# Altium schematic sheet Sheet4.SchDoc (part 1 of 3)
size E; SheetNumber: 1; SheetTotal: 1
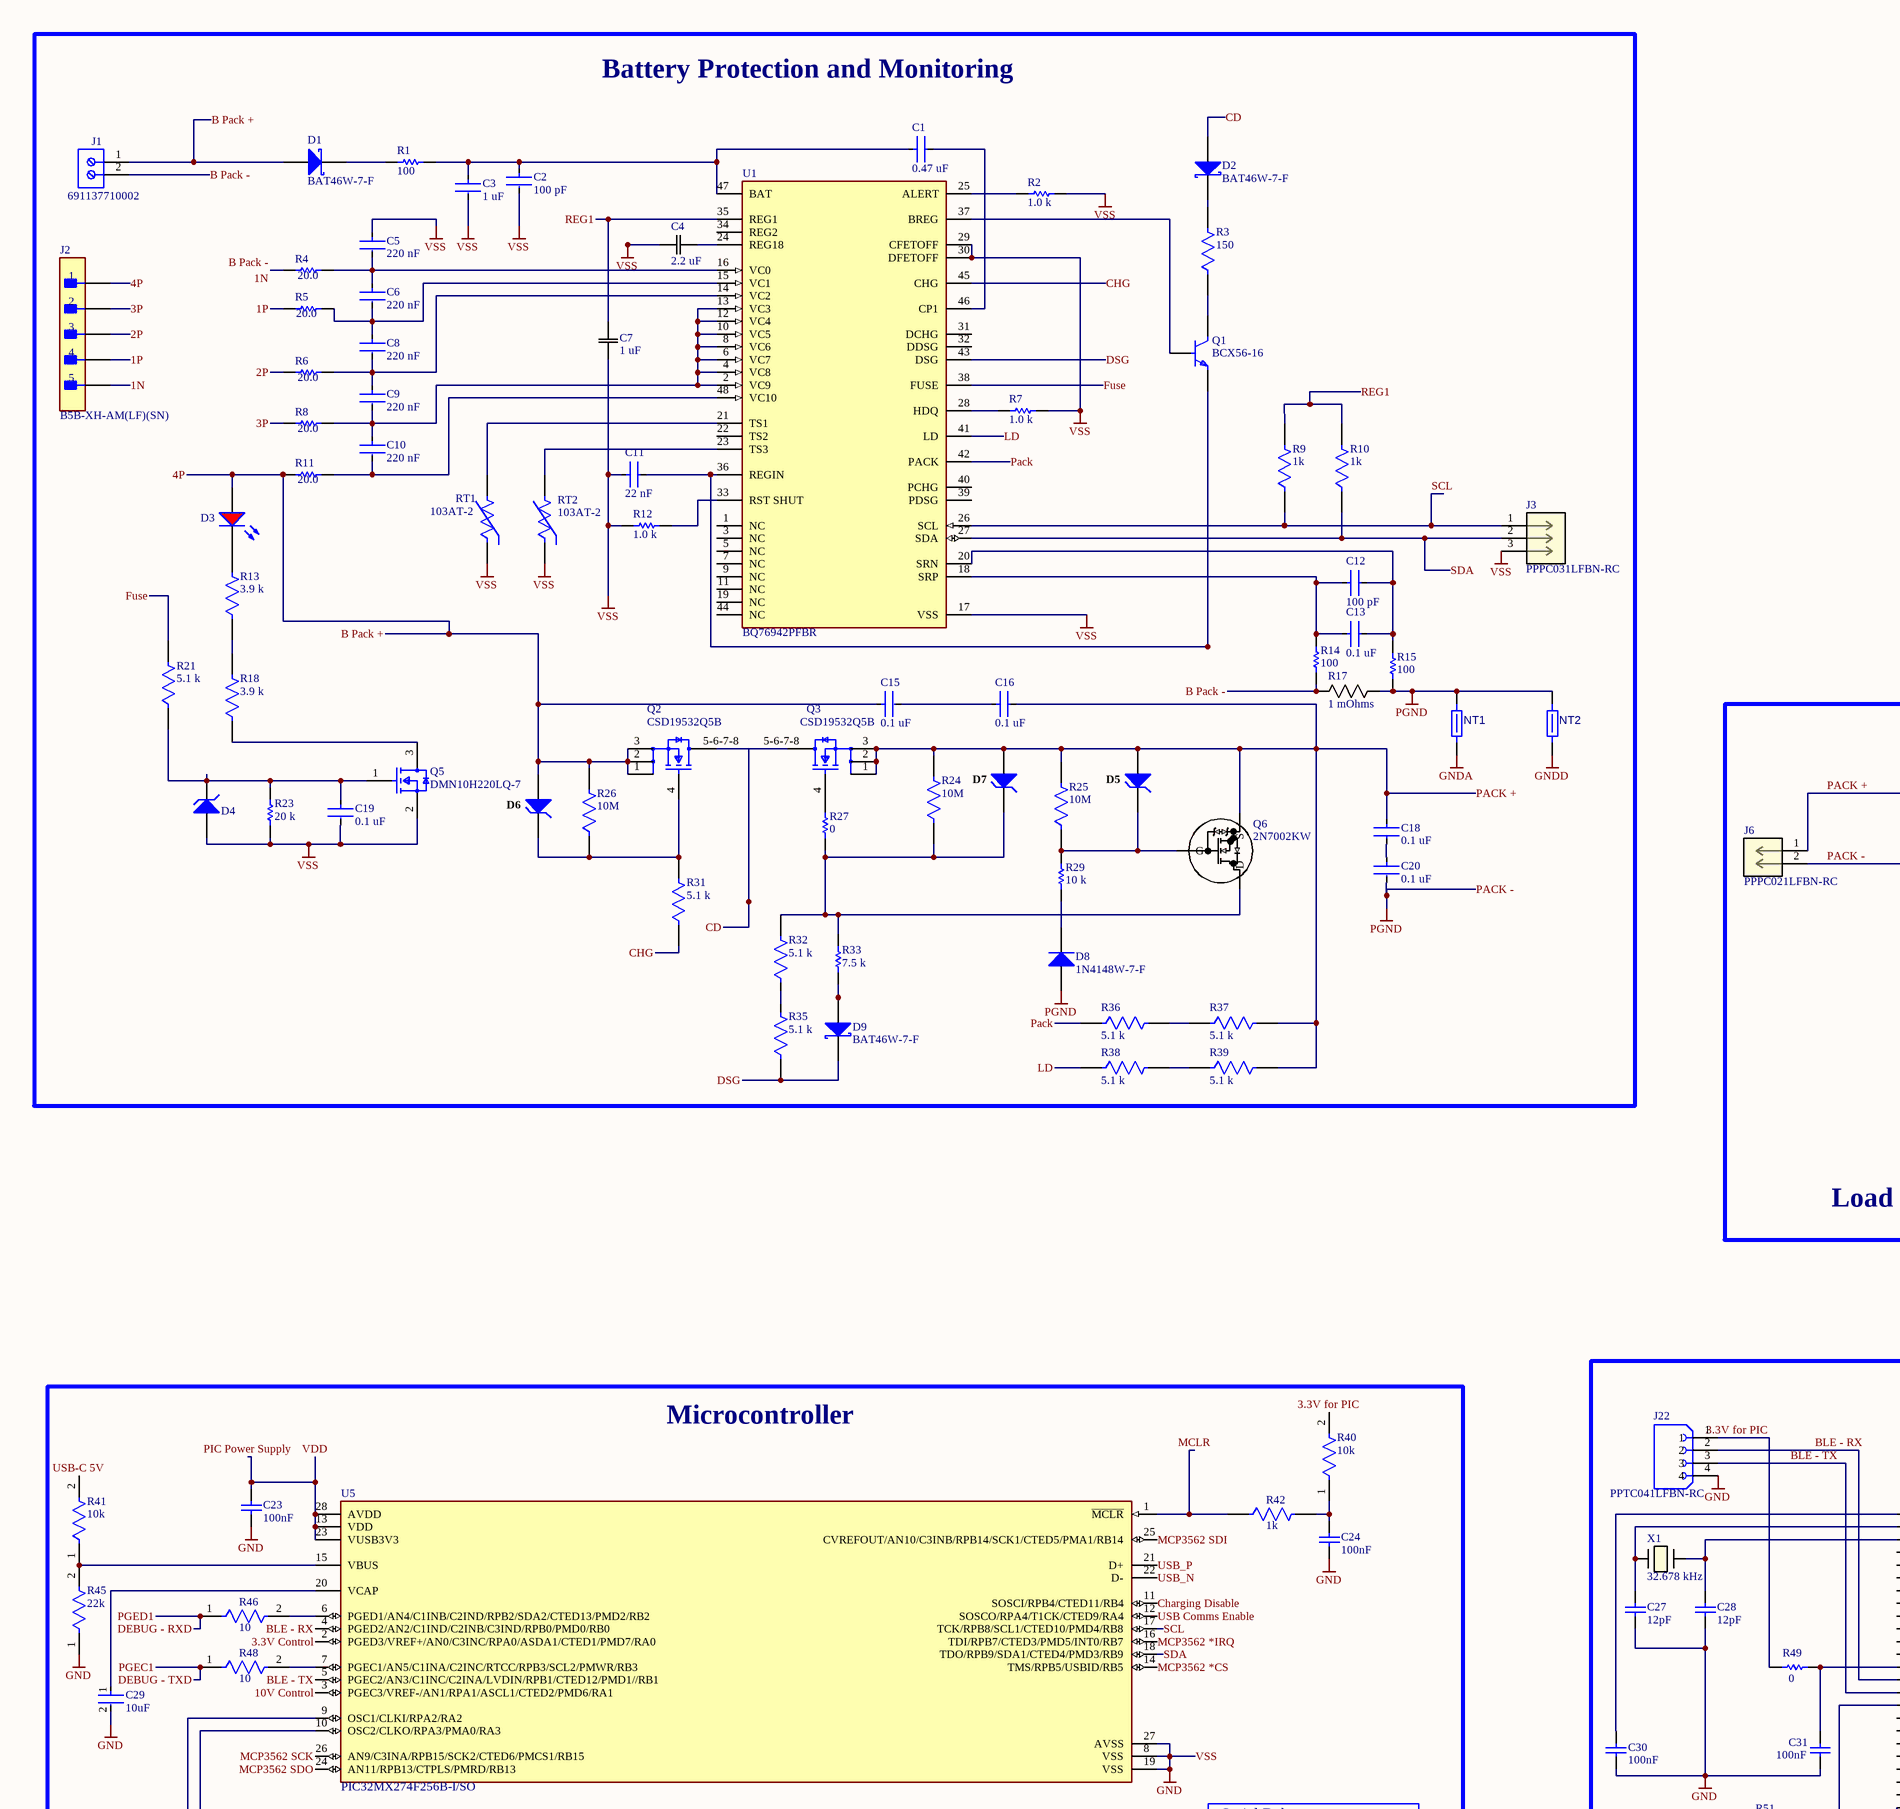
[diagram p0: Sheet4.SchDoc, top left]
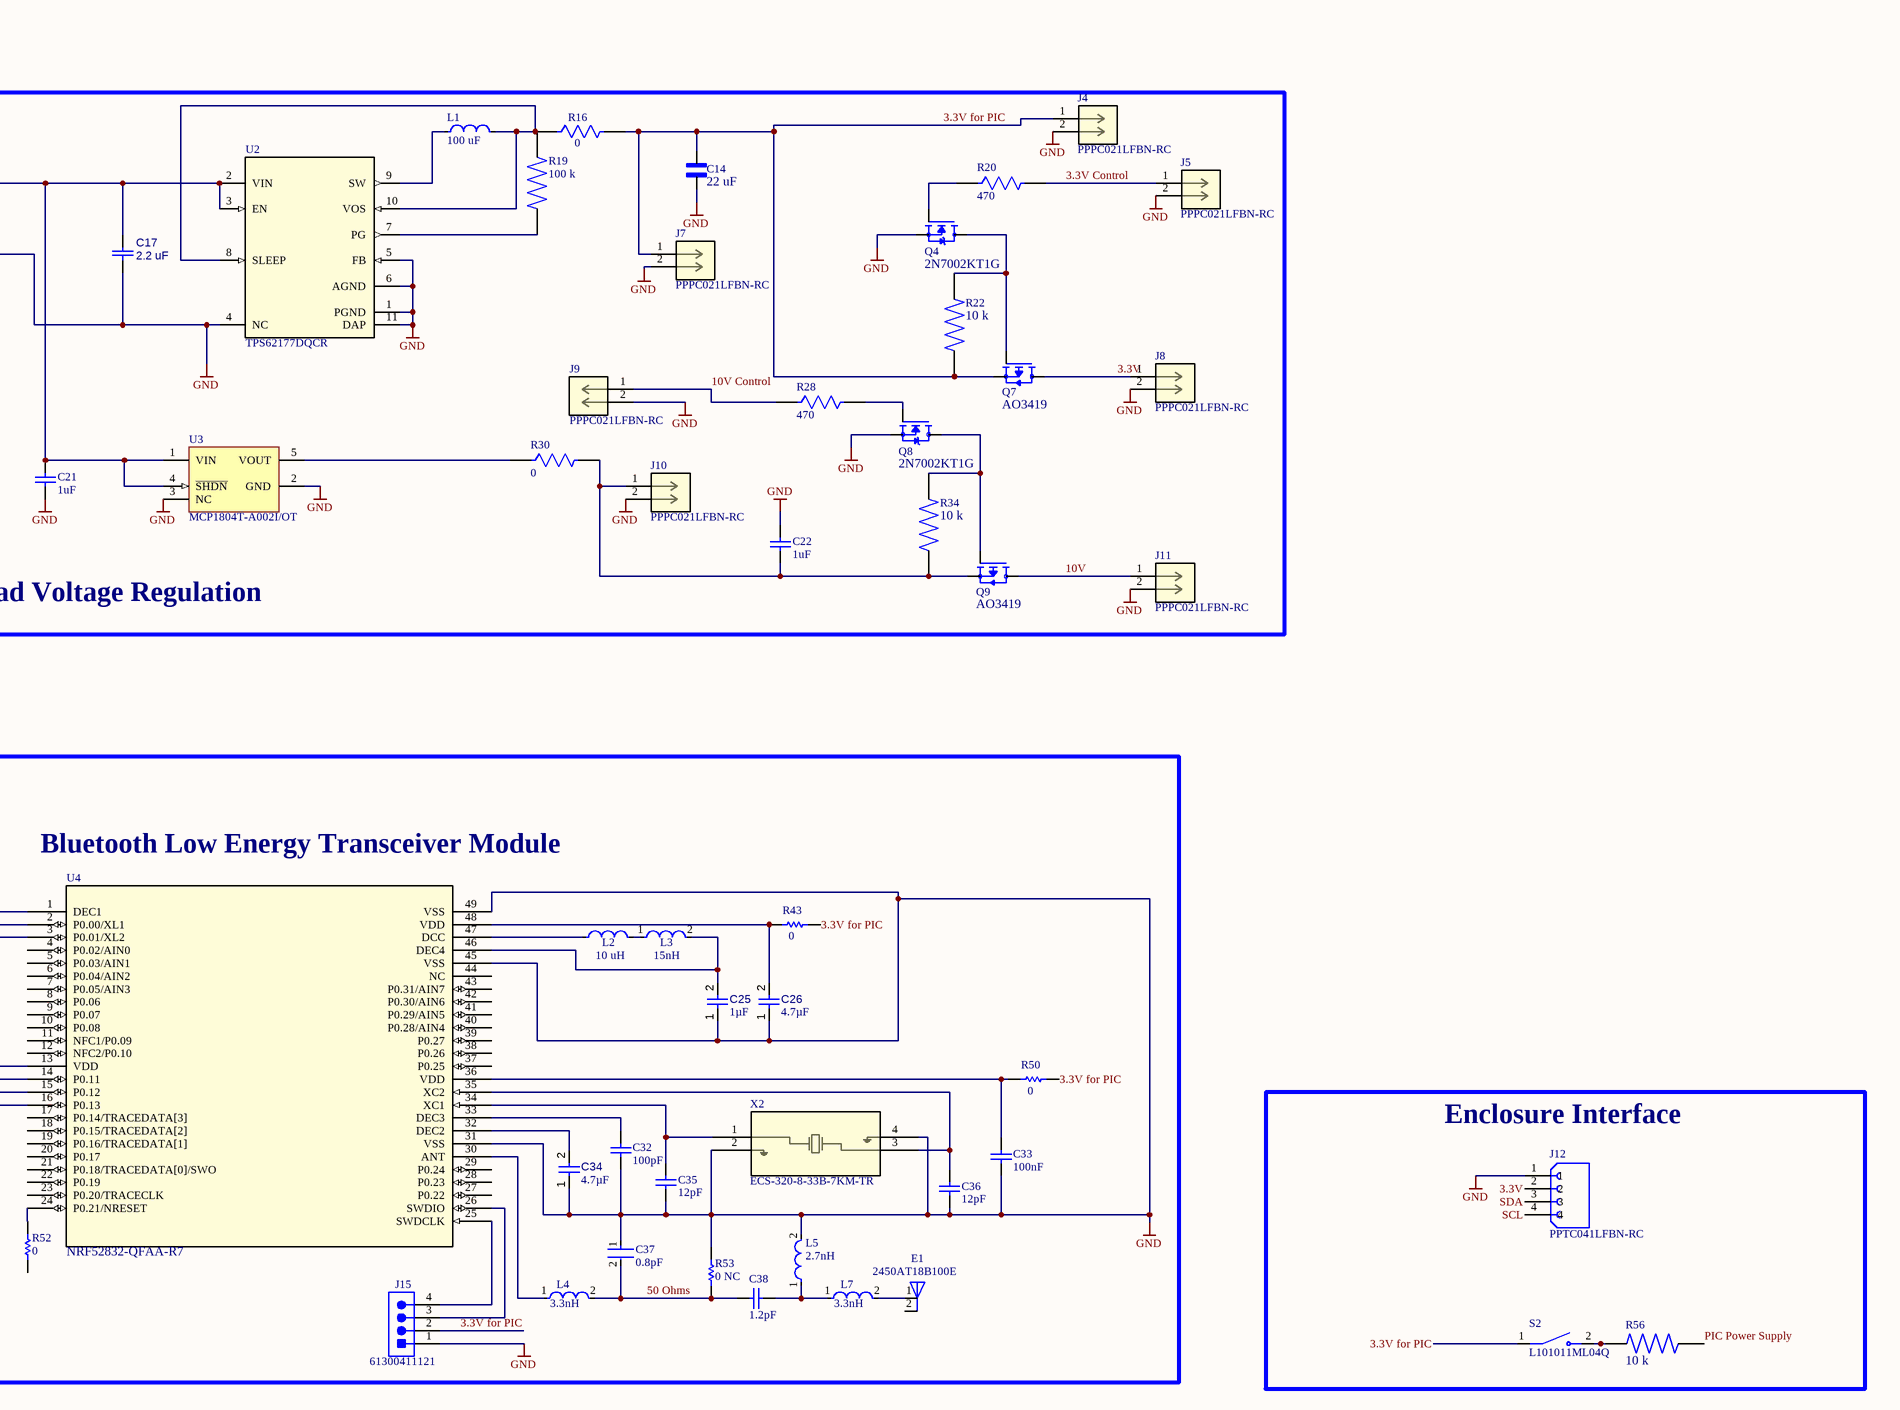
[diagram p1: Sheet4.SchDoc, top right]
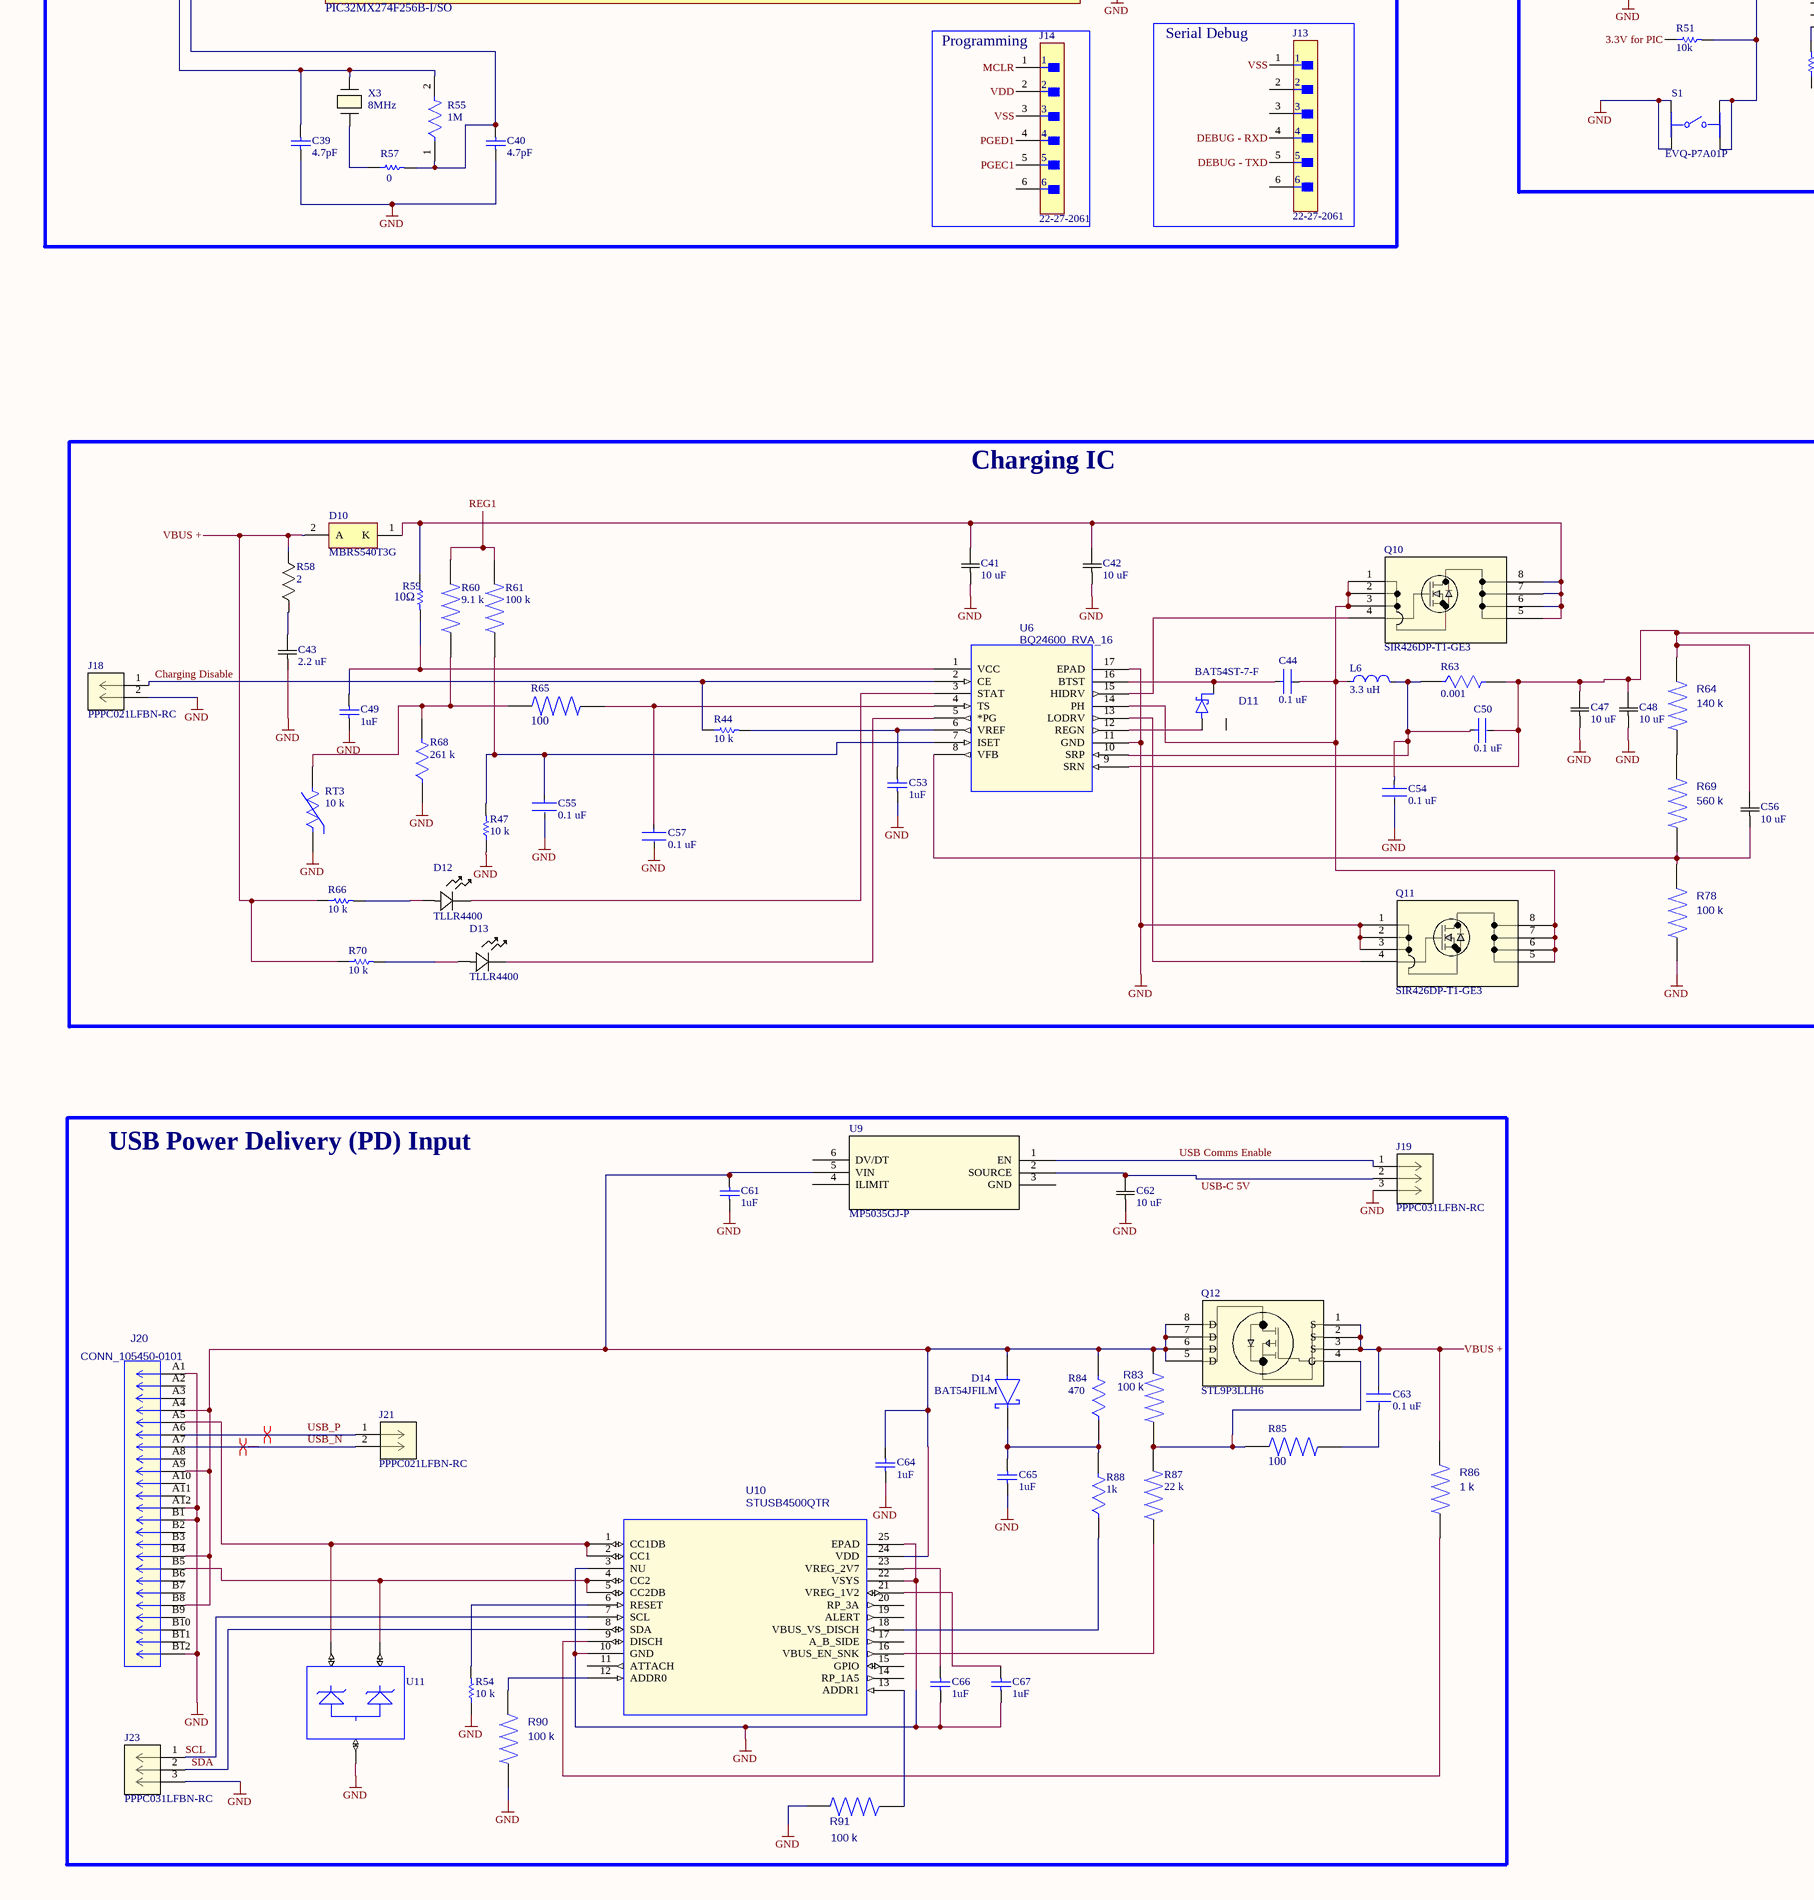
[diagram p2: Sheet4.SchDoc, bottom left]
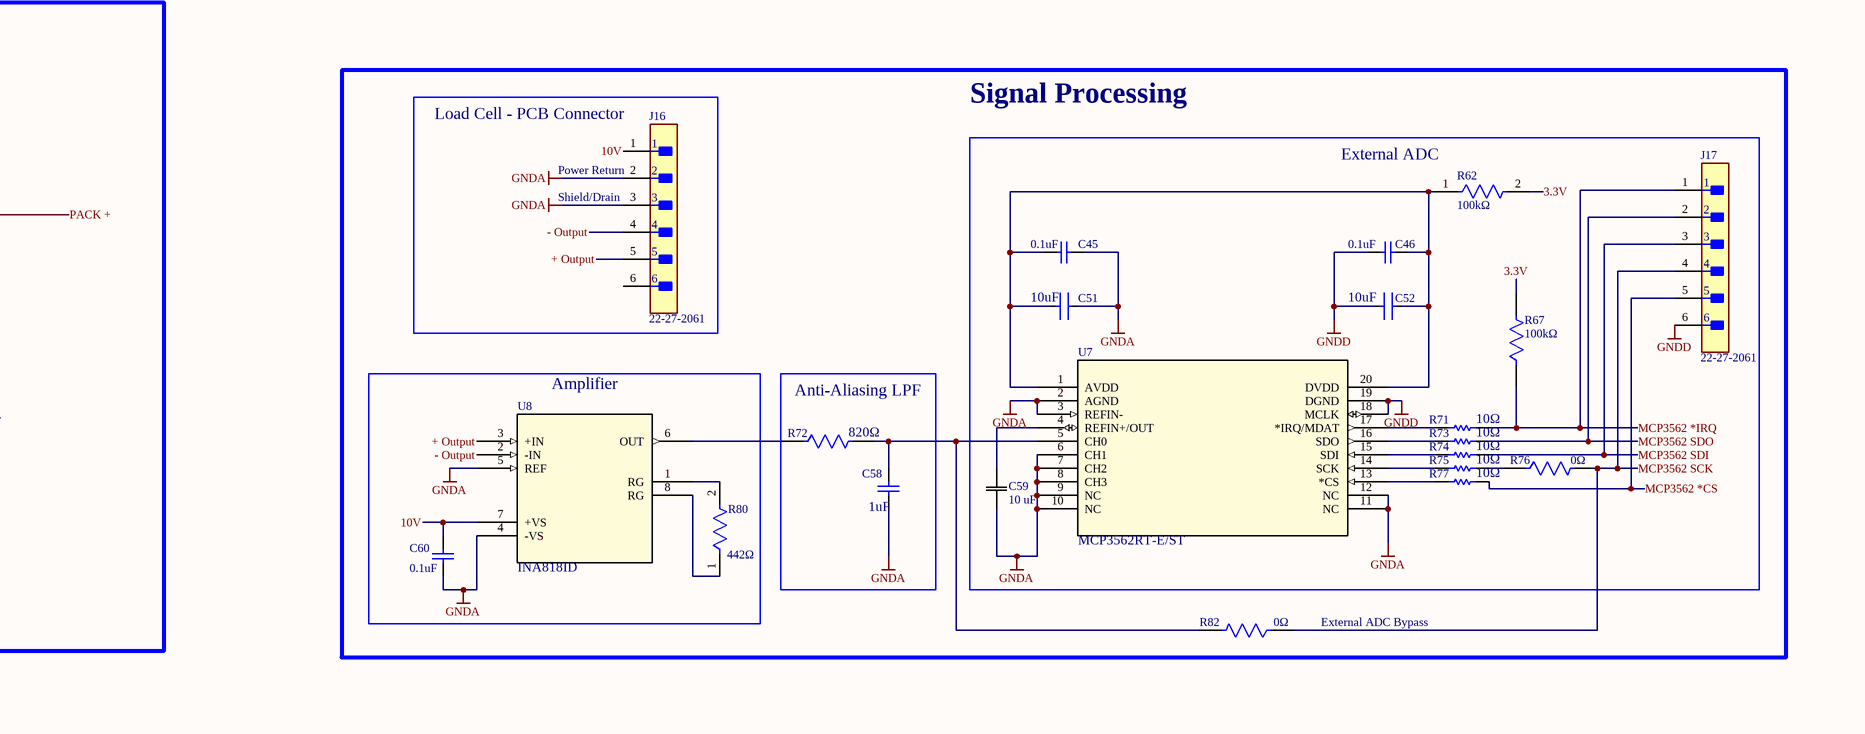
[diagram p3: Sheet4.SchDoc, bottom right]

## Parts
C1  0.47 uF  [FP-GCM219-0_15-MFG]
C2  100 pF  [FP-C0805C-DN-MFG]
C3  1 uF  [FP-C3216-160-0_2-IPC_B]
C4  2.2 uF  [CAPC2012X135N]
C5  220 nF  [FP-C2012-125-0_2-IPC_C]
C6  220 nF  [FP-C2012-125-0_2-IPC_C]
C7  1 uF  [CAPC2012X135N]
C8  220 nF  [FP-C2012-125-0_2-IPC_C]
C9  220 nF  [FP-C2012-125-0_2-IPC_C]
C10  220 nF  [FP-C2012-125-0_2-IPC_C]
C11  22 nF  [FP-C0805C-DN-MFG]
C12  100 pF  [FP-C0805C-DN-MFG]
C13  0.1 uF  [FP-GCJ21B-0_3-MFG]
C14  22 uF  [CAP_CL32_SAM]
C15  0.1 uF  [FP-GCJ21B-0_3-MFG]
C16  0.1 uF  [FP-GCJ21B-0_3-MFG]
C17  2.2 uF  [CAPC3216X180N]
C18  0.1 uF  [FP-GCJ21B-0_3-MFG]
C19  0.1 uF  [FP-GCJ21B-0_3-MFG]
C20  0.1 uF  [FP-GCJ21B-0_3-MFG]
C21  1uF  [CAPC1206(3216)150_M]
C22  1uF  [CAPC1206(3216)150_M]
C23  100nF  [CAPC2013X145X48NL20T23]
C24  100nF  [CAPC2013X145X48NL20T23]
C25  value 1µF  [CAPC2013X145X50ML20T25]  (hidden comment: Capacitor 1 uF +/- 10% 25 V 0805)
C26  value 4.7µF  [CAPC0805(2012)145_L]  (hidden comment: Capacitor 4.7µF +/-40% 25V 0805)
C27  12pF  [CAPC0805(2012)145_M]
C28  12pF  [CAPC0805(2012)145_M]
C29  10uF  [FP-C0805C106K3PACTU-MFG]
C30  100nF  [CAPC2013X145X48NL20T23]
C31  100nF  [CAPC2013X145X48NL20T23]
C32  100pF  [CAPC2013X145X48NL20T23]
C33  100nF  [CAPC2013X145X48NL20T23]
C34  value 4.7µF  [CAPC0805(2012)145_L]  (hidden comment: Capacitor 4.7µF +/-40% 25V 0805)
C35  12pF  [CAPC0805(2012)145_M]
C36  12pF  [CAPC0805(2012)145_M]
C37  0.8pF  [FP-CBR08C-MFG]
C38  1.2pF  [CAPC0805(2012)145_M]
C39  4.7pF  [CAPC0805(2012)75_N]
C40  4.7pF  [CAPC0805(2012)75_N]
C41  10 uF  [CAP_CL31_SAM]
C42  10 uF  [CAP_CL31_SAM]
C43  2.2 uF  [CAPC2012X135N]
C44  0.1 uF  [FP-CC1206-1_25-MFG]
C45  0.1uF  [CAPC2013X145X50NL20T25]
C46  0.1uF  [CAPC2013X145X50NL20T25]
C47  10 uF  [CAP_CL31_SAM]
C48  10 uF  [CAP_CL31_SAM]
C49  1uF  [CAPC1206(3216)150_M]
C50  0.1 uF  [FP-CC1206-1_25-MFG]
C51  10uF  [FP-CL21B106KOQNNNE-MFG]
C52  10uF  [FP-CL21B106KOQNNNE-MFG]
C53  1uF  [CAPC1206(3216)150_M]
C54  0.1 uF  [FP-CC1206-1_25-MFG]
C55  0.1 uF  [FP-CC1206-1_25-MFG]
C56  10 uF  [CAP_CL31_SAM]
C57  0.1 uF  [FP-CC1206-1_25-MFG]
C58  1uF  [CAPC2013X145X50LL20T25]
C59  10 uF  [CAP_CL31_SAM]
C60  0.1uF  [CAPC2013X145X50NL20T25]
C61  1uF  [CAPC1206(3216)150_M]
C62  10 uF  [CAP_CL31_SAM]
C63  0.1 uF  [FP-CC1206-1_25-MFG]
C64  1uF  [CAPC1206(3216)150_M]
C65  1uF  [CAPC1206(3216)150_M]
C66  1uF  [CAPC1206(3216)150_M]
C67  1uF  [CAPC1206(3216)150_M]
D1  BAT46W-7-F  [DIOD-SOD-123-2_V]
D2  BAT46W-7-F  [DIOD-SOD-123-2_V]
D3  150060RS75000  [WL-SMCW_0603_150060xx75000]  (value not drawn)
D4  MMSZ4697T1G  [ONSC-SOD-123-2-425-04_V]  (value not drawn)
D5  MMSZ5246B-E3-08  [VISH-SOD-123-2_V]  (value not drawn)
D6  MMSZ5246B-E3-08  [VISH-SOD-123-2_V]  (value not drawn)
D7  MMSZ5246B-E3-08  [VISH-SOD-123-2_V]  (value not drawn)
D8  1N4148W-7-F  [DIOD-SOD123-2_V]
D9  BAT46W-7-F  [DIOD-SOD-123-2_V]
D10  MBRS540T3G  [ONSC-SMC-2-403-03_V]
D11  Supplier Part Number 1: BAT54ST-7-F  [SOT523_DIO]
D12  TLLR4400  [TLL_Series_VIS]
D13  TLLR4400  [TLL_Series_VIS]
D14  BAT54JFILM  [FP-SOD323-MFG]
E1  2450AT18B100E  [XDCR_2450AT18B100E]
J1  691137710002  [691137710002]
J2  B5B-XH-AM(LF)(SN)  [FP-B5B-XH-AM_LF_SN-MFG]
J3  PPPC031LFBN-RC  [CONN_PPPC031LFBN-RC_SUL]
J4  PPPC021LFBN-RC  [CONN_PPPC021_SUL]
J5  PPPC021LFBN-RC  [CONN_PPPC021_SUL]
J6  PPPC021LFBN-RC  [CONN_PPPC021_SUL]
J7  PPPC021LFBN-RC  [CONN_PPPC021_SUL]
J8  PPPC021LFBN-RC  [CONN_PPPC021_SUL]
J9  PPPC021LFBN-RC  [CONN_PPPC021_SUL]
J10  PPPC021LFBN-RC  [CONN_PPPC021_SUL]
J11  PPPC021LFBN-RC  [CONN_PPPC021_SUL]
J12  PPTC041LFBN-RC  [SULLINS_PPTC041LFBN-RC]
J13  22-27-2061  [FP-22-27-2061-MFG]
J14  22-27-2061  [FP-22-27-2061-MFG]
J15  61300411121  [JST-S4B-XH-A(LF)(SN)_V]
J16  22-27-2061  [FP-22-27-2061-MFG]
J17  22-27-2061  [FP-22-27-2061-MFG]
J18  PPPC021LFBN-RC  [CONN_PPPC021_SUL]
J19  PPPC031LFBN-RC  [CONN_PPPC031LFBN-RC_SUL]
J20  CONN_105450-0101  [CONN_1054500101_MOL]
J21  PPPC021LFBN-RC  [CONN_PPPC021_SUL]
J22  PPTC041LFBN-RC  [SULLINS_PPTC041LFBN-RC]
J23  PPPC031LFBN-RC  [CONN_PPPC031LFBN-RC_SUL]
L1  100 uF  [FP-CB3225-IPC_A]
L2  10 uH  [FP-MLZ2012-1_25-MFG]
L3  15nH  [FP-LQW2BHN_03-MFG]
L4  3.3nH  [FP-LQW2BHN_03-MFG]
L5  2.7nH  [FP-LQW2BHN_03-MFG]
L6  3.3 uH  [FP-IHLP-5050EZ-FP_3_226x4-MFG]
L7  3.3nH  [FP-LQW2BHN_03-MFG]
NT1  Net Tie 12x8mil  [SHORT06-FP]  (value not drawn)  (net tie, no BOM)
NT2  Net Tie 12x8mil  [SHORT06-FP]  (value not drawn)  (net tie, no BOM)
Q1  BCX56-16  [FP-SOT89-MFG]
Q2  CSD19532Q5B  [FP-DNK0008A-MFG]
Q3  CSD19532Q5B  [FP-DNK0008A-MFG]
Q4  2N7002KT1G  [SOT95P240X111-3N]
Q5  DMN10H220LQ-7  [FP-SOT23-MFG]
Q6  2N7002KW  [SC-70_419AB-01_OSI]
Q7  AO3419  [SOT95P237X112-3N]
Q8  2N7002KT1G  [SOT95P240X111-3N]
Q9  AO3419  [SOT95P237X112-3N]
Q10  SIR426DP-T1-GE3  [POWERPAK_SO-8_SINGLE]
Q11  SIR426DP-T1-GE3  [POWERPAK_SO-8_SINGLE]
Q12  STL9P3LLH6  [POWERFLAT_3P3X3P3_STM]
R1  100  [RESC2013X70X40ML20T20]
R2  1.0 k  [RESC2013X70X40ML20T20]
R3  150  [FP-CRCW2512-e3-IPC_B]
R4  20.0  [RESC3216X60X45ML10T20]
R5  20.0  [RESC3216X60X45ML10T20]
R6  20.0  [RESC3216X60X45ML10T20]
R7  1.0 k  [RESC2013X70X40ML20T20]
R8  20.0  [RESC3216X60X45ML10T20]
R9  1k  [FP-RMCF0805-MFG]
R10  1k  [FP-RMCF0805-MFG]
R11  20.0  [RESC3216X60X45ML10T20]
R12  1.0 k  [RESC2013X70X40ML20T20]
R13  3.9 k  [Vishay_CRCW1206-e3_MFG]
R14  100  [RESC2013X70X40ML20T20]
R15  100  [RESC2013X70X40ML20T20]
R16  0  [FP-RMCF0805-MFG]
R17  1 mOhms  [RES_R2512_ROM]
R18  3.9 k  [Vishay_CRCW1206-e3_MFG]
R19  100 k  [RESC5025X65N]
R20  470  [FP-CRGCQ0805-IPC_C]
R21  5.1 k  [FP-CRCW1206-e3-IPC_A]
R22  10 k  [RESC5025X65N]
R23  20 k  [RESC2013X70X40NL20T20]
R24  10M  [FP-RMCF0805-IPC_A]
R25  10M  [FP-RMCF0805-IPC_A]
R26  10M  [FP-RMCF0805-IPC_A]
R27  0  [RESC2013X65X40LL15T20]
R28  470  [FP-CRGCQ0805-IPC_C]
R29  10 k  [RESC2013X70X40LL20T20]
R30  0  [FP-RMCF0805-MFG]
R31  5.1 k  [FP-CRCW1206-e3-IPC_A]
R32  5.1 k  [FP-CRCW1206-e3-IPC_A]
R33  7.5 k  [RESC2013X70X40LL20T20]
R34  10 k  [RESC5025X65N]
R35  5.1 k  [FP-CRCW1206-e3-IPC_A]
R36  5.1 k  [FP-CRCW1206-e3-IPC_A]
R37  5.1 k  [FP-CRCW1206-e3-IPC_A]
R38  5.1 k  [FP-CRCW1206-e3-IPC_A]
R39  5.1 k  [FP-CRCW1206-e3-IPC_A]
R40  10k  [FP-AT0805-MFG]
R41  10k  [FP-AT0805-MFG]
R42  1k  [FP-RMCF0805-MFG]
R43  0  [RESC2013X65X40LL15T20]
R44  10 k  [RESC2013X70X40LL20T20]
R45  22k  [FP-MCU0805-IPC_C]
R46  10  [FP-RT0805-MFG]
R47  10 k  [RESC2013X70X40LL20T20]
R48  10  [FP-RT0805-MFG]
R49  0  [RESC2013X65X40LL15T20]
R50  0  [RESC2013X65X40LL15T20]
R51  10k  [RESC0805(2012)_L]
R52  0  [RESC2013X65X40LL15T20]
R53  0 NC  [RESC2013X65X40LL15T20]
R54  10 k  [RESC2013X70X40LL20T20]
R55  1M  [FP-MCU0805-IPC_B]
R56  10 k  [RESC5025X65N]
R57  0  [RESC2013X65X40LL15T20]
R58  2  [RES_RMCF2010_STP]
R59  10Ω  [RESC2013X60X35NL10T20]
R60  9.1 k  [RESC5025X65N]
R61  100 k  [RESC5025X65N]
R62  100kΩ  [FP-CRCW0805-e3-MFG]
R63  0.001  [FP-WSL2010-1_47-MFG]
R64  140 k  [RES_RMCF2010_STP]
R65  100  [RESC3126X65N]
R66  10 k  [RESC2013X70X40LL20T20]
R67  100kΩ  [FP-CRCW0805-e3-MFG]
R68  261 k  [FP-CRCW2512-e3-IPC_B]
R69  560 k  [RESC5025X65N]
R70  10 k  [RESC2013X70X40LL20T20]
R71  10Ω  [RESC2013X60X35NL10T20]
R72  820Ω  [FP-AC0805-MFG]
R73  10Ω  [RESC2013X60X35NL10T20]
R74  10Ω  [RESC2013X60X35NL10T20]
R75  10Ω  [RESC2013X60X35NL10T20]
R76  0Ω  [FP-RCC0805-e3-MFG]
R77  10Ω  [RESC2013X60X35NL10T20]
R78  100 k  [RESC5025X65N]
R80  442Ω  [FP-RN73R2A-IPC_C]
R82  0Ω  [FP-RCC0805-e3-MFG]
R83  100 k  [RESC5025X65N]
R84  470  [FP-CRGCQ0805-IPC_C]
R85  100  [RESC3126X65N]
R86  1 k  [RESC5025X65N]
R87  22 k  [RESC5025X65N]
R88  1k  [FP-RMCF0805-MFG]
R90  100 k  [RESC5025X65N]
R91  100 k  [RESC5025X65N]
RT1  103AT-2  [FP-103AT-2-MFG]
RT2  103AT-2  [FP-103AT-2-MFG]
RT3  10 k  [FP-NCP15-NCU15-0_05-IPC_A]
S1  EVQ-P7A01P  [FP-EVQ-P7A01P-MFG]
S2  L101011ML04Q  [SW_L101011ML04Q]
U1  BQ76942PFBR  [FP-PFB0048A-IPC_C]
U2  TPS62177DQCR  [DQC0010A]
U3  MCP1804T-A002I/OT  [SOT-23-OT5_N]
U4  NRF52832-QFAA-R7  [QFN48_6X6_QF_NOR]
U5  PIC32MX274F256B-I/SO  [FP-C04-052-MFG]
U6  BQ24600_RVA_16  [RVA16_2P14X2P14]
U7  MCP3562RT-E/ST  [TSSOP20_ST_MCH]
U8  INA818ID  [SOIC-8_TEX]
U9  MP5035GJ-P  [TSOT23-6_MP5035_MNP]
U10  STUSB4500QTR  [QFN24_STUSB4500_STM]
U11  ESDA25L  [SOT_A25L_STM]  (value not drawn)
X1  32.678 kHz  [XTAL_FC-135R_EPS]
X2  ECS-320-8-33B-7KM-TR  [ECS-33B_ECS]
X3  8MHz  [XTAL_NX3225GD-8MHZ-STD-CRA-3_NDK]

## Blocks framed on the sheet
Battery Protection and Monitoring: C1-C13 C15 C16 C18-C20 D1-D9 J1-J3 NT1 NT2 Q1-Q3 Q5 Q6 R1-R15 R17 R18 R21 R23-R27 R29 R31-R33 R35-R39 RT1 RT2 U1
Load Voltage Regulation: C14 C17 C21 C22 J4-J11 L1 Q4 Q7-Q9 R16 R19 R20 R22 R28 R30 R34 U2 U3
Microcontroller: C23 C24 C29 C39 C40 R40-R42 R45 R46 R48 R55 R57 U5 X3
Bluetooth Low Energy Transceiver Module: C25-C28 C30-C38 E1 J15 J22 L2-L5 L7 R43 R49-R53 S1 U4 X1 X2
Enclosure Interface: J12 R56 S2
Programming: J14
Serial Debug: J13
Charging IC: C41-C44 C47-C50 C53-C57 D10-D13 J18 L6 Q10 Q11 R44 R47 R58-R61 R63-R66 R68-R70 R78 RT3 U6
Signal Processing: R82
Load Cell - PCB Connector: J16
External ADC: C45 C46 C51 C52 C59 J17 R62 R67 R71 R73-R77 U7
Amplifier: C60 R80 U8
Anti-Aliasing LPF: C58 R72
USB Power Delivery (PD) Input: C61-C67 D14 J19-J21 J23 Q12 R54 R83-R88 R90 R91 U9-U11

## Nets
GNDA: C45.2 C51.1 C58.1 C59.1 C60.1 J16.2 J16.3 NT1.1 U7.2(AGND) U7.3(REFIN-) U7.6(CH1) U7.7(CH2) U7.8(CH3) U7.9(NC) U7.10(NC) U7.11(NC) U7.12(NC) U8.4(-VS) U8.5(REF)
GNDD: C46.1 C52.2 J17.6 NT2.1 U7.18(MCLK) U7.19(DGND)
PACK -: C2.2 C3.2 C4.1 C5.1 C7.1 C11.1 C14.1 C17.1 C19.2 C20.2 C21.1 C22.2 C23.1 C24.1 C25.1 C26.1 C27.1 C28.1 C29.2 C30.1 C31.1 C32.1 C33.1 C34.1 C35.1 C36.1 C37.1 C39.1 C40.1 C41.1 C42.1 C43.1 C47.1 C48.1 C49.1 C53.1 C54.2 C55.2 C57.2 C61.1 C62.1 C64.1 C65.1 C66.1 C67.1 D4.2(A) D8.1(A) J3.3 J4.2 J5.2 J6.2 J7.2 J8.2 J9.2 J10.2 J11.2 J12.1 J13.1 J14.3 J15.1 J18.2 J19.3 J20.A1 J20.A12 J20.B1 J20.B12 J22.4 J23.3 L5.2 NT1.2 NT2.2 Q4.2(S) Q5.2(S) Q8.2(S) Q11.1(S) Q11.2(S) Q11.3(S) R2.2 R7.2 R12.1 R15.1 R17.2 R23.1 R45.1 R47.1 R53.2 R54.1 R68.1 R78.1 R90.1 R91.1 RT1.1 RT2.1 RT3.1 S1.2 S1.2' U1.17(VSS) U1.29(CFETOFF) U1.30(DFETOFF) U2.1(PGND) U2.4(NC) U2.5(FB) U2.6(AGND) U2.11(DAP) U3.2(GND) U3.3(NC) U4.31(VSS) U4.45(VSS) U4.49(VSS) U5.8(VSS) U5.19(VSS) U5.27(AVSS) U6.11(GND) U6.17(EPAD) U10.3(NU) U10.10(GND) U10.22(VSYS) U10.25(EPAD) U11.3 X2.2 X2.4  [also labelled GND, PGND, VSS]
1N: J1.2 J2.5 R4.1 R14.1 R17.1  [also labelled B Pack -]
1P: J2.4 R5.1
2P: J2.3 R6.1
3.3V: J8.1 J12.2 Q7.3(D) R62.2 R67.2
3.3V Control: J5.1 R20.2 U5.2(PGED3/VREF+/AN0/C3INC/RPA0/ASDA1/CTED1/PMD7/RA0)
3.3V for PIC: C14.2 J4.1 J7.1 J15.2 J22.1 Q7.2(S) R16.2 R22.1 R40.2 R43.2 R49.1 R50.2 R51.1 S2.1(COM)
3P: J2.2 R8.1
4P: C15.1 D1.1(A) D3.2(A) D6.1(A) J1.1 J2.1 Q2.1(S) Q2.2(S) Q2.3(S) R11.1 R26.2  [also labelled B Pack +]
10V: C60.2 J11.1 J16.1 Q9.3(D) U8.7(+VS)
10V Control: J9.1 R28.1 U5.3(PGEC3/VREF-/AN1/RPA1/ASCL1/CTED2/PMD6/RA1)
50 Ohms: C37.2 C38.2 L4.2 R53.1
+ Output: J16.5 U8.3(+IN)
- Output: J16.4 U8.2(-IN)
BLE - RX: J22.2 U4.14(P0.11) U5.4(PGED2/AN2/C1IND/C2INB/C3IND/RPB0/PMD0/RB0)
BLE - TX: J22.3 U4.15(P0.12) U5.5(PGEC2/AN3/C1INC/C2INA/LVDIN/RPB1/CTED12/PMD1//RB1)
CD: D2.1(A) Q2.5-6-7-8(D) Q3.5-6-7-8(D)
Charging Disable: J18.1 R44.1 U5.11(SOSCI/RPB4/CTED11/RB4) U6.2(CE)
CHG: R31.1 U1.45(CHG)
DEBUG - RXD: J13.4 J14.4 R46.1  [also labelled PGED1]
DEBUG - TXD: J13.5 J14.5 R48.1  [also labelled PGEC1]
DSG: D9.2(K) R35.1 U1.43(DSG)
Fuse: R21.2 U1.38(FUSE)
LD: R38.1 U1.41(LD)
MCLR: J14.1 R42.1 U5.1(~{MCLR})
MCP3562 *CS: J17.5 R77.2 U5.14(TMS/RPB5/USBID/RB5)
MCP3562 *IRQ: J17.1 R67.1 R71.2 U5.16(TDI/RPB7/CTED3/PMD5/INT0/RB7)
MCP3562 SCK: J17.4 R76.2 R82.1 U5.26(AN9/C3INA/RPB15/SCK2/CTED6/PMCS1/RB15)
MCP3562 SDI: J17.3 R74.2 U5.25(CVREFOUT/AN10/C3INB/RPB14/SCK1/CTED5/PMA1/RB14)
MCP3562 SDO: J17.2 R73.2 U5.24(AN11/RPB13/CTPLS/PMRD/RB13)
Pack: R36.1 U1.42(PACK)
PACK +: C16.2 C17.2 C18.1 C21.2 C47.2 C48.2 C50.2 C56.2 D5.1(A) D7.1(A) J6.1 Q3.1(S) Q3.2(S) Q3.3(S) Q6.2(S) R24.2 R25.2 R37.2 R39.2 R63.2 R64.2 U2.2(VIN) U2.3(EN) U3.1(VIN) U3.4(~{SHDN}) U6.9(SRN)
PIC Power Supply: C23.2 J14.2 R56.2 U5.13(VDD) U5.23(VUSB3V3) U5.28(AVDD)  [also labelled VDD]
REG1: C7.2 R9.2 R10.2 R60.2 R61.2 U1.35(REG1)
SCL: J3.1 J12.4 J23.1 R9.1 U1.26(SCL) U5.17(TCK/RPB8/SCL1/CTED10/PMD4/RB8) U10.7(SCL)
SDA: J3.2 J12.3 J23.2 R10.1 U1.27(SDA) U5.18(TDO/RPB9/SDA1/CTED4/PMD3/RB9) U10.8(SDA)
USB Comms Enable: J19.1 U5.12(SOSCO/RPA4/T1CK/CTED9/RA4) U9.1(EN)
USB-C 5V: C62.2 J19.2 R41.2 U9.2(SOURCE)
USB_N: J20.A7 J21.2 U5.22(D-)
USB_P: J20.A6 J21.1 U5.21(D+)
VBUS +: C63.1 D10.2(A) Q12.1(S) Q12.2(S) Q12.3(S) R58.2 R66.1 R70.1 R86.2
NetC1_1: C1.1 C2.1 C3.1 R1.2 U1.47(BAT)
NetC1_2: C1.2 U1.46(CP1)
NetC4_2: C4.2 U1.24(REG18)
NetC5_2: C5.2 C6.1 R4.2 U1.16(VC0)
NetC6_2: C6.2 C8.1 R5.2 U1.15(VC1)
NetC8_2: C8.2 C9.1 R6.2 U1.14(VC2)
NetC9_2: C9.2 C10.1 R8.2 U1.2(VC9) U1.4(VC8) U1.6(VC7) U1.8(VC6) U1.10(VC5) U1.12(VC4) U1.13(VC3)
NetC10_2: C10.2 R11.2 U1.48(VC10)
NetC11_2: C11.2 Q1.1(E) U1.36(REGIN)
NetC12_1: C12.1 C13.1 R14.2 U1.18(SRP)
NetC12_2: C12.2 C13.2 R15.2 U1.20(SRN)
NetC15_2: C15.2 C16.1
NetC18_2: C18.2 C20.1
NetC19_1: C19.1 D4.1(K) Q5.1(G) R21.1 R23.2
NetC22_1: C22.1 J10.1 Q9.2(S) R30.2 R34.1
NetC24_2: C24.2 R40.1 R42.2
NetC25_2: C25.2 L3.2 U4.46(DEC4)
NetC26_2: C26.2 R43.1 U4.48(VDD)
NetC27_2: C27.2 U4.2(P0.00/XL1) X1.1
NetC28_2: C28.2 U4.3(P0.01/XL2) X1.2
NetC29_1: C29.1 U5.20(VCAP)
NetC30_2: C30.2 U4.1(DEC1)
NetC31_2: C31.2 R49.2 U4.13(VDD)
NetC32_2: C32.2 U4.33(DEC3)
NetC33_2: C33.2 R50.1 U4.36(VDD)
NetC34_2: C34.2 U4.32(DEC2)
NetC35_2: C35.2 U4.34(XC1) X2.1
NetC36_2: C36.2 U4.35(XC2) X2.3
NetC38_1: C38.1 L5.1 L7.1
NetC39_2: C39.2 R55.2 U5.9(OSC1/CLKI/RPA2/RA2) X3.2
NetC40_2: C40.2 R55.1 R57.2 U5.10(OSC2/CLKO/RPA3/PMA0/RA3)
NetC41_2: C41.2 C42.2 D10.1(K) Q10.5(D) Q10.6(D) Q10.7(D) Q10.8(D) R59.1
NetC43_2: C43.2 R58.1
NetC44_1: C44.1 D11.3 U6.16(BTST)
NetC44_2: C44.2 L6.1 Q10.1(S) Q10.2(S) Q10.3(S) Q11.5(D) Q11.6(D) Q11.7(D) Q11.8(D) U6.14(PH)
NetC45_1: C45.1 C46.2 C51.2 C52.1 R62.1 U7.1(AVDD) U7.20(DVDD)
NetC49_2: C49.2 R59.2 U6.1(VCC)
NetC50_1: C50.1 C54.1 L6.2 R63.1 U6.10(SRP)
NetC53_2: C53.2 R44.2 U6.6(VREF)
NetC55_1: C55.1 R47.2 R61.1 U6.7(ISET)
NetC56_1: C56.1 R69.1 R78.2 U6.8(VFB)
NetC57_1: C57.1 R65.2 U6.4(TS)
NetC58_2: C58.2 R72.2 R82.2 U7.5(CH0)
NetC59_2: C59.2 U7.4(REFIN+/OUT)
NetC61_2: C61.2 C64.2 D14.2(A) J20.A4 J20.A9 J20.B4 J20.B8 Q12.5(D) Q12.6(D) Q12.7(D) Q12.8(D) R83.2 R84.2 U9.5(VIN) U10.24(VDD)
NetC63_2: C63.2 R85.2
NetC65_2: C65.2 D14.1(C) R84.1 R88.2
NetC66_2: C66.2 U10.23(VREG_2V7)
NetC67_2: C67.2 U10.21(VREG_1V2)
NetD1_2: D1.2(K) R1.1
NetD2_2: D2.2(K) R3.2
NetD3_1: D3.1(K) R13.2
NetD5_2: D5.2(K) Q6.1(G) R25.1 R29.2
NetD6_2: D6.2(K) Q2.4(G) R26.1 R31.2
NetD7_2: D7.2(K) Q6.3(D) R24.1 R27.1 R32.2 R33.2
NetD8_2: D8.2(K) R29.1
NetD9_1: D9.1(A) R33.1
NetD11_1: D11.1 U6.12(REGN)
NetD12_1: D12.1 U6.3(STAT)
NetD12_2: D12.2 R66.2
NetD13_1: D13.1 U6.5(*PG)
NetD13_2: D13.2 R70.2
NetE1_1: E1.1(FEED) L7.2
NetJ15_3: J15.3 U4.26(SWDIO)
NetJ15_4: J15.4 U4.25(SWDCLK)
NetJ20_A5: J20.A5 U10.1(CC1DB) U10.2(CC1) U11.2
NetJ20_B5: J20.B5 U10.4(CC2) U10.5(CC2DB) U11.1
NetL1_1: L1.1 U2.9(SW)
NetL1_2: L1.2 R16.1 R19.2 U2.8(SLEEP) U2.10(VOS)
NetL2_1: L2.1 U4.47(DCC)
NetL2_2: L2.2 L3.1
NetL4_1: L4.1 U4.30(ANT)
NetQ1_2: Q1.2(C) R3.1
NetQ1_3: Q1.3(B) U1.37(BREG)
NetQ3_4: Q3.4(G) R27.2
NetQ4_1: Q4.1(G) R20.1
NetQ4_3: Q4.3(D) Q7.1(G) R22.2
NetQ5_3: Q5.3(D) R18.1
NetQ8_1: Q8.1(G) R28.2
NetQ8_3: Q8.3(D) Q9.1(G) R34.2
NetQ10_4: Q10.4(G) U6.15(HIDRV)
NetQ11_4: Q11.4(G) U6.13(LODRV)
NetQ12_4: Q12.4(G) R83.1 R85.1 R87.2
NetR2_1: R2.1 U1.25(ALERT)
NetR7_1: R7.1 U1.28(HDQ)
NetR12_2: R12.2 U1.33(RST_SHUT)
NetR13_1: R13.1 R18.2
NetR19_1: R19.1 U2.7(PG)
NetR30_1: R30.1 U3.5(VOUT)
NetR32_1: R32.1 R35.2
NetR36_2: R36.2 R37.1
NetR38_2: R38.2 R39.1
NetR41_1: R41.1 R45.2 U5.15(VBUS)
NetR46_2: R46.2 U5.6(PGED1/AN4/C1INB/C2IND/RPB2/SDA2/CTED13/PMD2/RB2)
NetR48_2: R48.2 U5.7(PGEC1/AN5/C1INA/C2INC/RTCC/RPB3/SCL2/PMWR/RB3)
NetR51_2: R51.2 S1.1 S1.1' U4.16(P0.13)
NetR52_2: R52.2 U4.24(P0.21/NRESET)
NetR54_2: R54.2 U10.6(RESET)
NetR56_1: R56.1 S2.2(NO)
NetR57_1: R57.1 X3.1
NetR60_1: R60.1 R65.1 R68.2 RT3.2
NetR64_1: R64.1 R69.2
NetR71_1: R71.1 U7.17(*IRQ/MDAT)
NetR72_1: R72.1 U8.6(OUT)
NetR73_1: R73.1 U7.16(SDO)
NetR74_1: R74.1 U7.15(SDI)
NetR75_1: R75.1 U7.14(SCK)
NetR75_2: R75.2 R76.1
NetR77_1: R77.1 U7.13(*CS)
NetR80_1: R80.1 U8.8(RG)
NetR80_2: R80.2 U8.1(RG)
NetR86_1: R86.1 U10.9(DISCH)
NetR87_1: R87.1 U10.16(VBUS_EN_SNK)
NetR88_1: R88.1 U10.18(VBUS_VS_DISCH)
NetR90_2: R90.2 U10.12(ADDR0)
NetR91_2: R91.2 U10.13(ADDR1)
NetRT1_2: RT1.2 U1.21(TS1)
NetRT2_2: RT2.2 U1.23(TS3)

Not connected (* = marked no-connect by the designer): D11 2(NC); E1 2(NC); J13 2 3 6; J14 6; J16 6; J20 A2 A3 A8 A10 A11 B2 B3 B6 B7 B9 B10 B11; R52 1; U1 1(NC) 3(NC) 5(NC) 7(NC) 9(NC) 11(NC) 19(NC) 22(TS2) 31(DCHG) 32(DDSG) 34(REG2) 39(PDSG) 40(PCHG) 44(NC); U4 4(P0.02/AIN0) 5(P0.03/AIN1) 6(P0.04/AIN2) 7(P0.05/AIN3) 8(P0.06) 9(P0.07) 10(P0.08) 11(NFC1/P0.09) 12(NFC2/P0.10) 17(P0.14/TRACEDATA[3]) 18(P0.15/TRACEDATA[2]) 19(P0.16/TRACEDATA[1]) 20(P0.17) 21(P0.18/TRACEDATA[0]/SWO) 22(P0.19) 23(P0.20/TRACECLK) 27(P0.22) 28(P0.23) 29(P0.24) 37(P0.25) 38(P0.26) 39(P0.27) 40(P0.28/AIN4) 41(P0.29/AIN5) 42(P0.30/AIN6) 43(P0.31/AIN7) 44(NC); U9 3(GND) 4(ILIMIT) 6(DV/DT); U10 11(ATTACH) 14(RP_1A5) 15(GPIO) 17(A_B_SIDE) 19(ALERT) 20(RP_3A)

## Layout directives
differential pair: USB_N, USB_P

## Notes on the sheet
- (near J16) Shield/Drain
- (near J16) Power Return
- External ADC Bypass